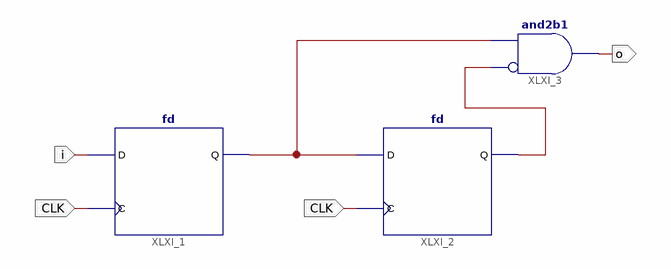
[diagram p0: schematic sheet 1]
// Xilinx ISE schematic switch_design.sch (spartan3) as structural Verilog: 3 symbols, 3 ports
module switch_design (
  input  i,
  input  CLK,
  output o
);

  wire XLXN_2, XLXN_3;

  fd XLXI_1 (.C(CLK), .D(i), .Q(XLXN_2));
  fd XLXI_2 (.C(CLK), .D(XLXN_2), .Q(XLXN_3));
  and XLXI_3 (o, ~XLXN_3, XLXN_2);  // and2b1
endmodule
